# EAGLE design lcd_brd (EAGLE 6.2)
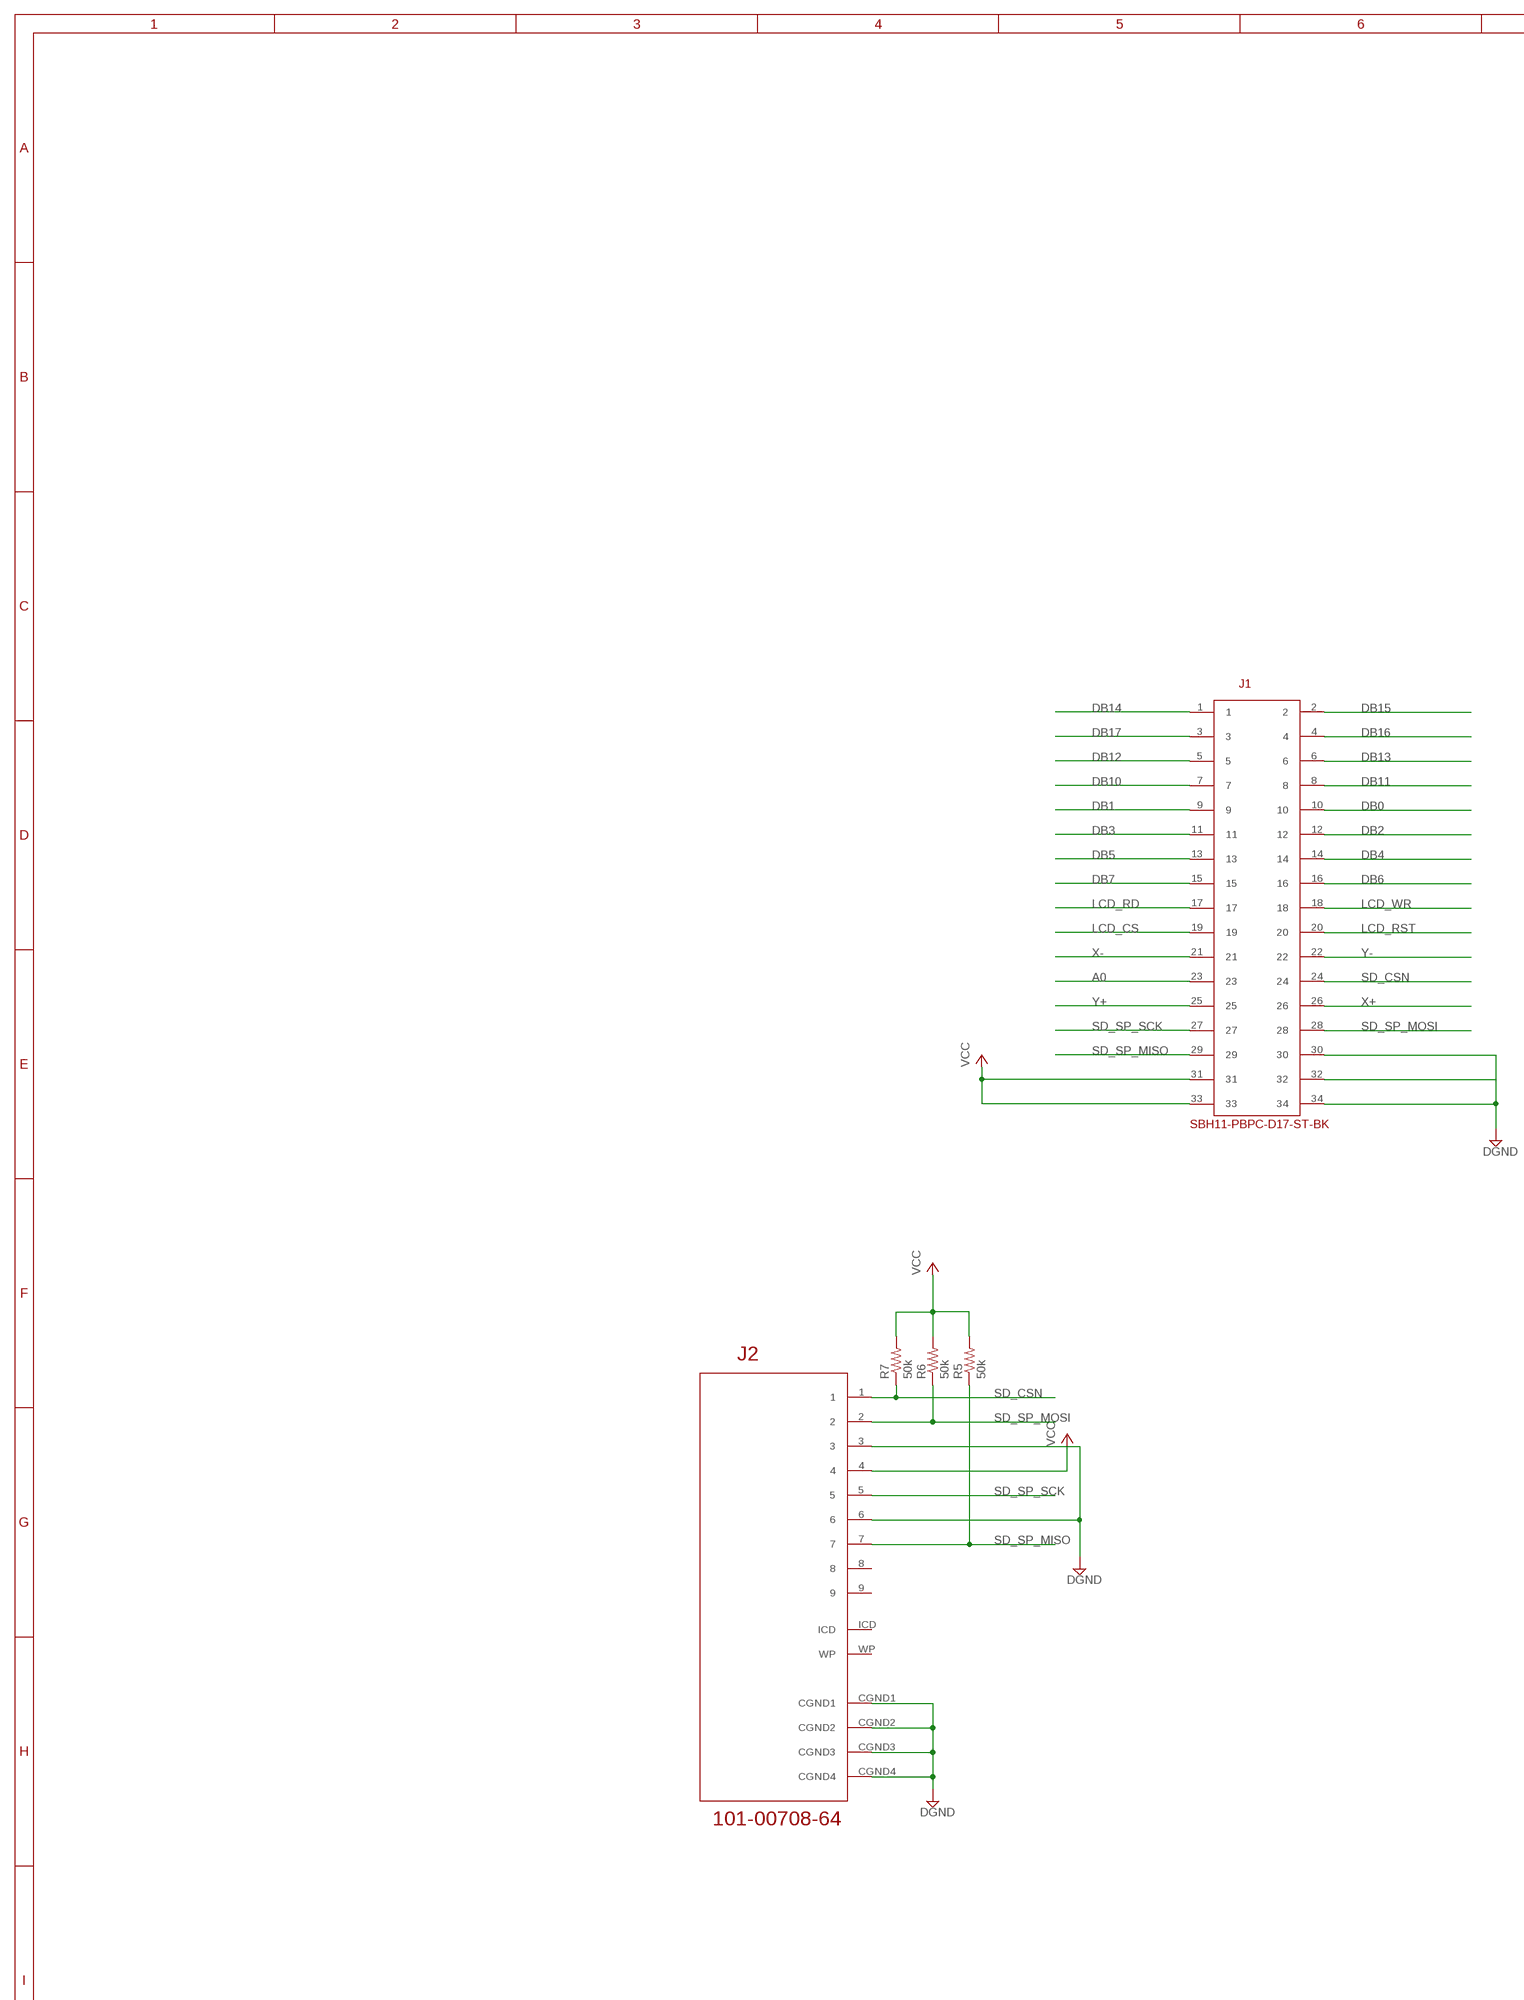
[diagram p0: schematic, sheet 1, part 1 of 2]
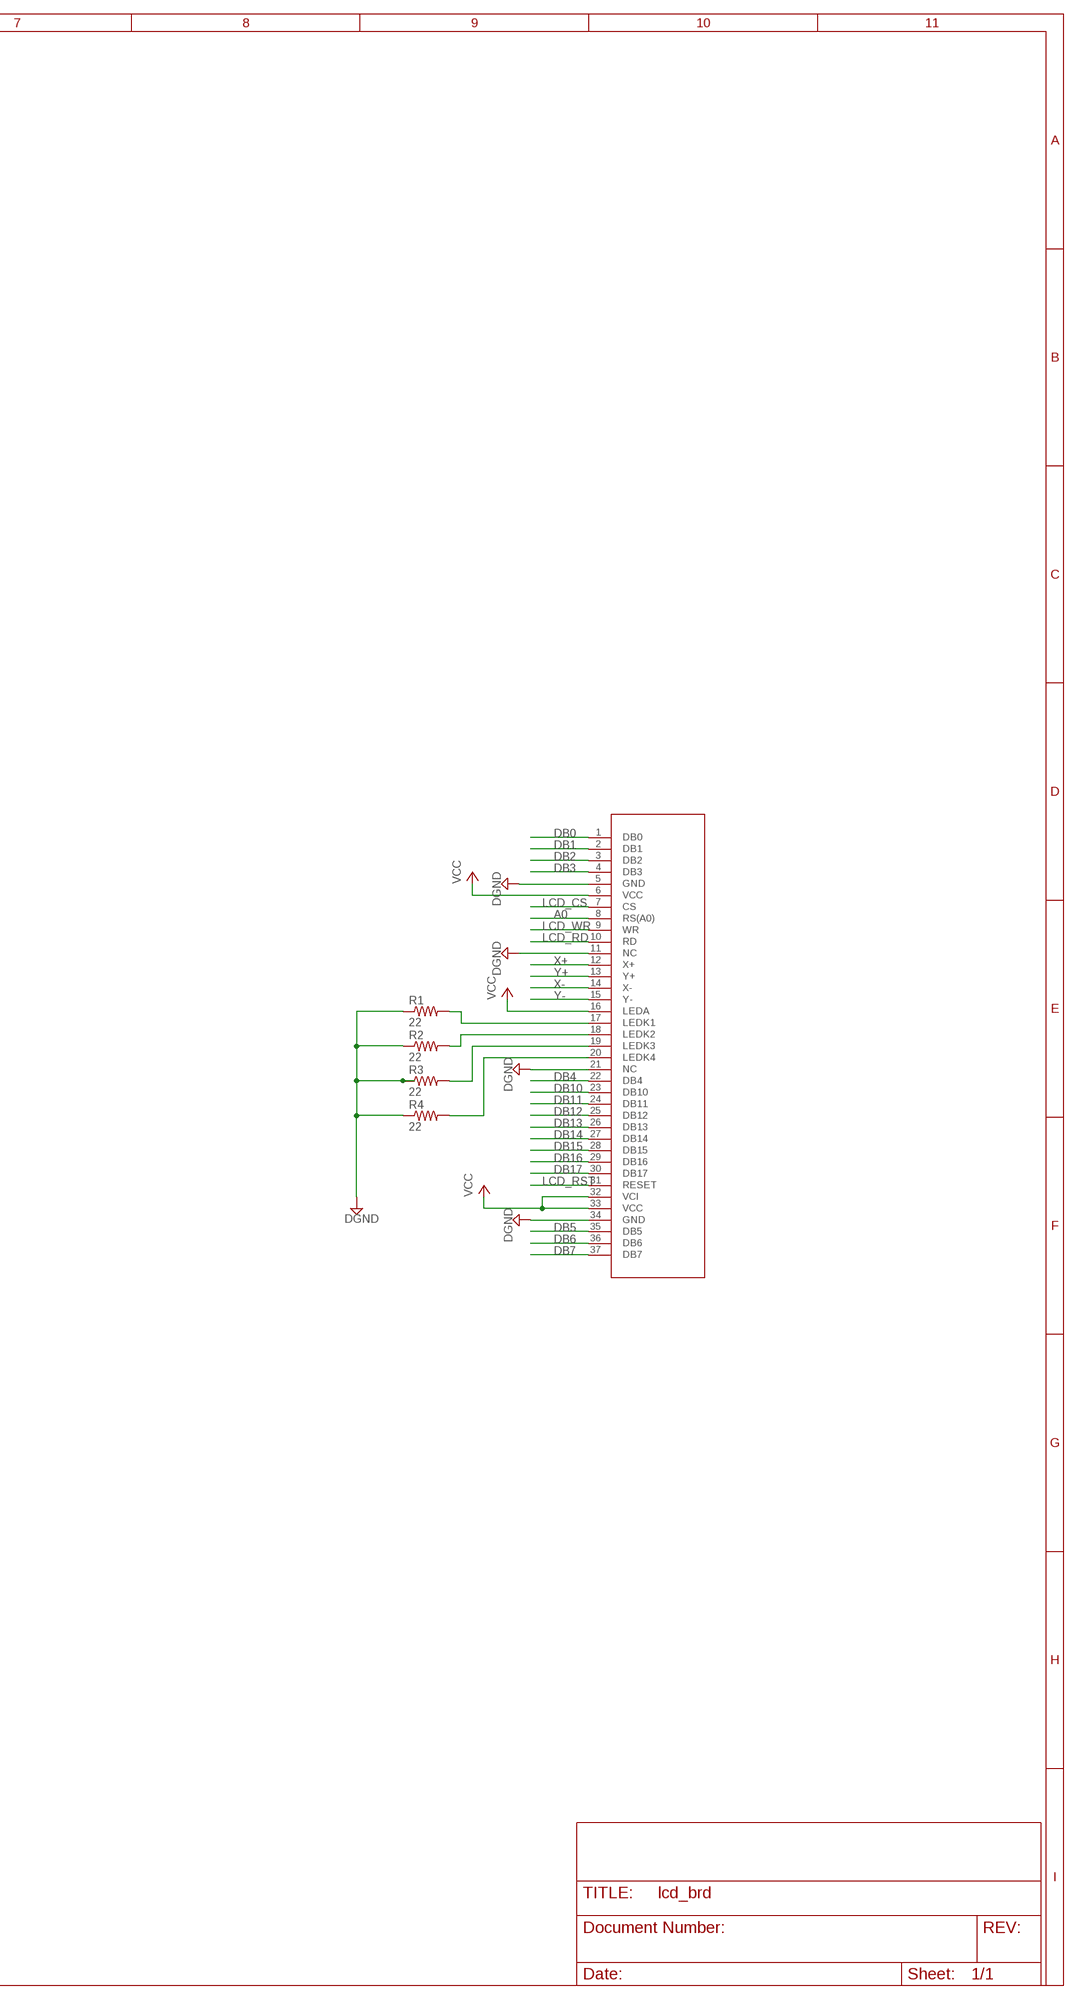
[diagram p1: schematic, sheet 1, part 2 of 2]

## Parts
J1  SBH11-PBPC-D17-ST-BK  [SBH11-PBPC-D17-ST-BK]
J2  101-00708-64  [101-00708-64]
R1  22  R-US_R0603  [R0603]
R2  22  R-US_R0603  [R0603]
R3  22  R-US_R0603  [R0603]
R4  22  R-US_R0603  [R0603]
R5  50k  R-US_R0603  [R0603]
R6  50k  R-US_R0603  [R0603]
R7  50k  R-US_R0603  [R0603]
U1  PETERATMEGA644_LCD37  [PETERATMEGA644_LCD371MM]

## Nets
A0: J1.23 U1.8(RS(A0))
DB0: J1.10 U1.1(DB0)
DB1: J1.9 U1.2(DB1)
DB2: J1.12 U1.3(DB2)
DB3: J1.11 U1.4(DB3)
DB4: J1.14 U1.22(DB4)
DB5: J1.13 U1.35(DB5)
DB6: J1.16 U1.36(DB6)
DB7: J1.15 U1.37(DB7)
DB10: J1.7 U1.23(DB10)
DB11: J1.8 U1.24(DB11)
DB12: J1.5 U1.25(DB12)
DB13: J1.6 U1.26(DB13)
DB14: J1.1 U1.27(DB14)
DB15: J1.2 U1.28(DB15)
DB16: J1.4 U1.29(DB16)
DB17: J1.3 U1.30(DB17)
DGND: J1.30 J1.32 J1.34 J2.3 J2.6 J2.CGND1 J2.CGND2 J2.CGND3 J2.CGND4 R1.1 R2.1 R3.1 R4.1 U1.5(GND) U1.11(NC) U1.21(NC) U1.34(GND)
LCD_CS: J1.19 U1.7(CS)
LCD_RD: J1.17 U1.10(RD)
LCD_RST: J1.20 U1.31(RESET)
LCD_WR: J1.18 U1.9(WR)
N$1: R1.2 U1.17(LEDK1)
N$3: R2.2 U1.18(LEDK2)
N$4: R3.2 U1.19(LEDK3)
N$6: R4.2 U1.20(LEDK4)
SD_CSN: J1.24 J2.1 R7.1
SD_SP_MISO: J1.29 J2.7 R5.1
SD_SP_MOSI: J1.28 J2.2 R6.1
SD_SP_SCK: J1.27 J2.5
VCC: J1.31 J1.33 J2.4 R5.2 R6.2 R7.2 U1.6(VCC) U1.16(LEDA) U1.32(VCI) U1.33(VCC)
X+: J1.26 U1.12(X+)
X-: J1.21 U1.14(X-)
Y+: J1.25 U1.13(Y+)
Y-: J1.22 U1.15(Y-)
Unconnected: J2.8 J2.9 J2.ICD J2.WP

## Library data of the parts
J1 = SBH11-PBPC-D17-ST-BK:SBH11-PBPC-D17-ST-BK
J2 = 101-00708-64:101-00708-64
R1-R7 = resistor:R-US_: RESISTOR, American symbol
U1 = microtouch:PETERATMEGA644_LCD37: 2.4 Inch LCD Panel JCTTQ2437PS01-T01

## Board
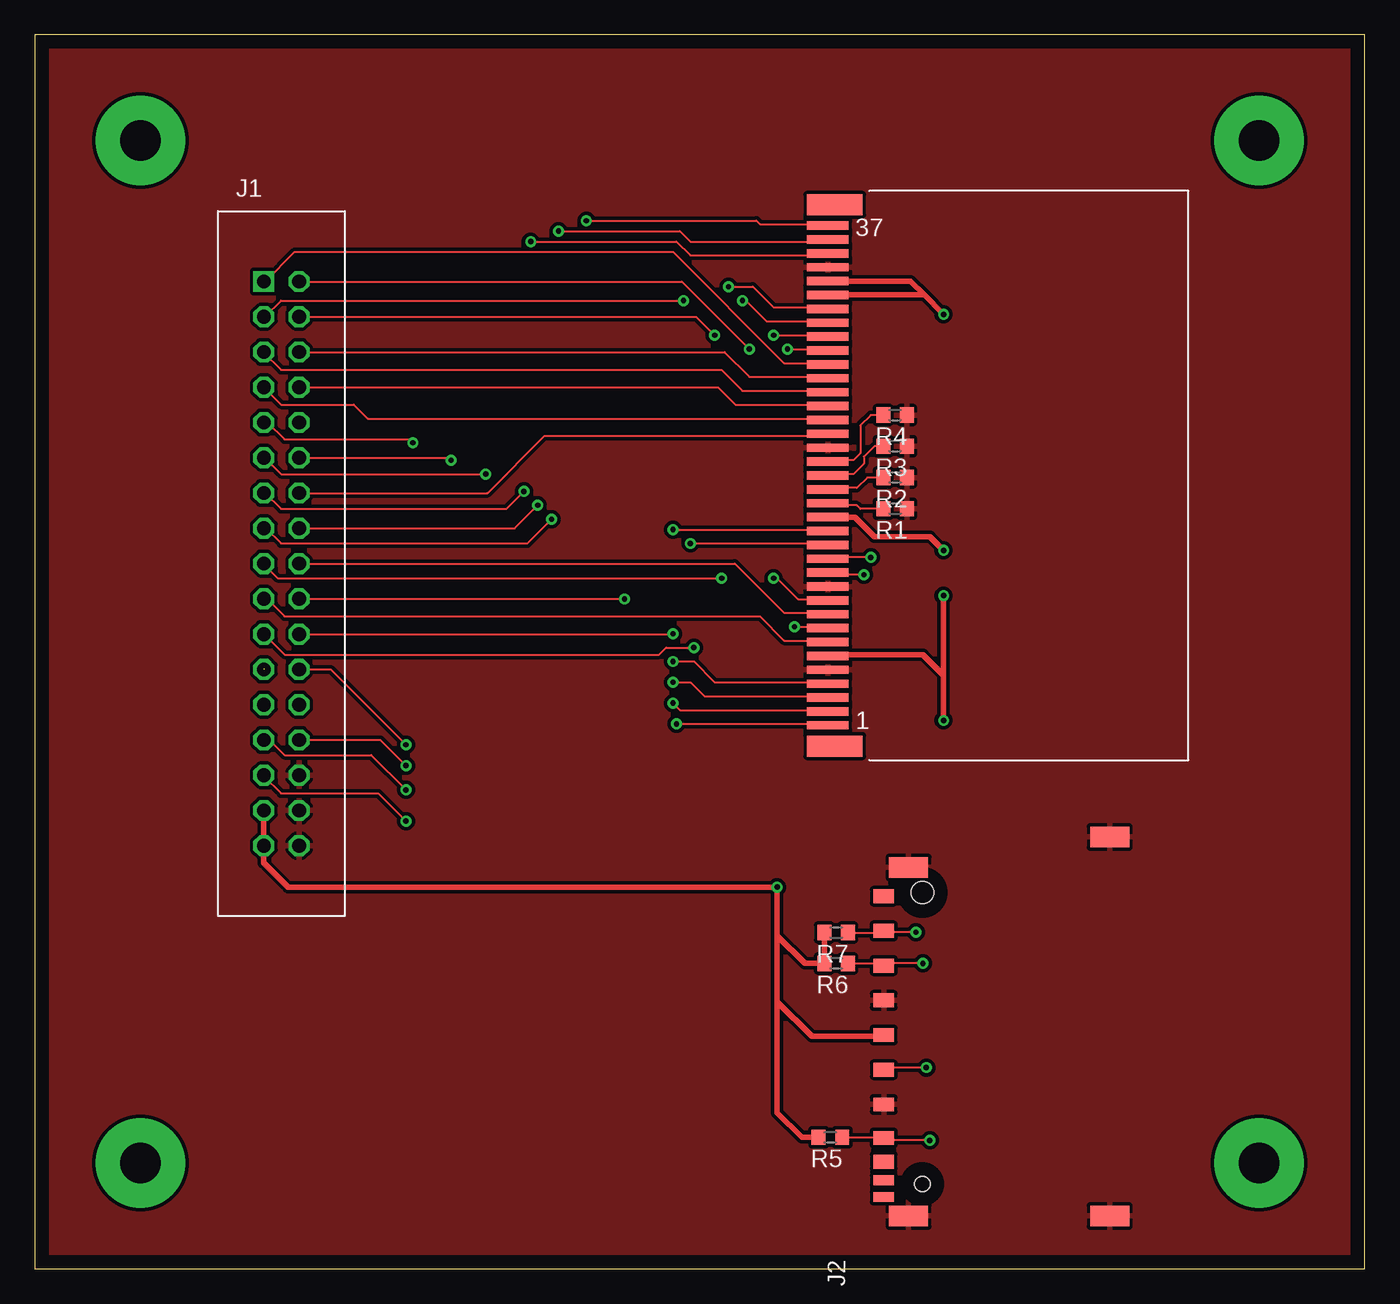
[diagram p2: board, top side]
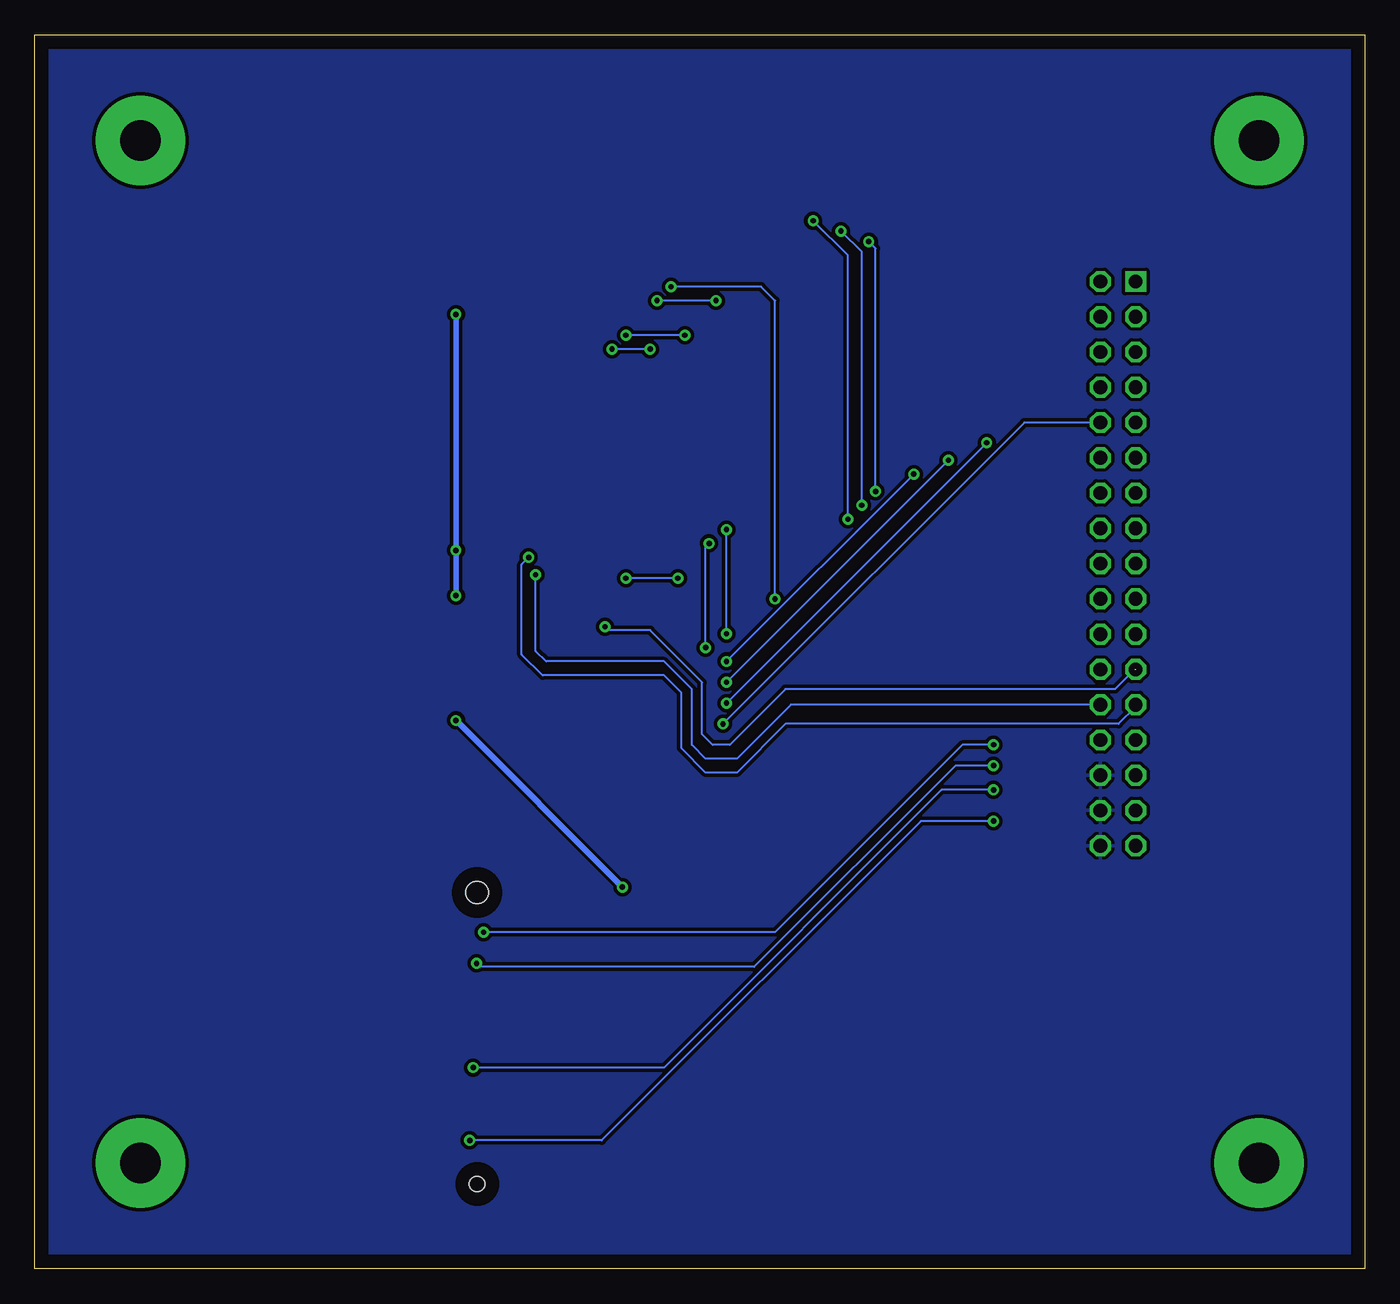
[diagram p3: board, bottom side, seen from below]

Size 95.85 x 88.9 mm. Coordinates in mm from the lower left corner, seen from the top.
Outline: 0,0 95.85,0 95.85,88.9 0,88.9 0,0
Copper layers (1*16): Top 0.035mm / dielectric 1.5mm / Bottom 0.035mm
Design rules: minimum track width 6mil, minimum drill 15mil, track to track 6mil, track to pad 6mil, pad to pad 6mil, via to via 6mil, smd to smd 6mil, copper to edge 40mil, drill to drill 8mil, minimum pad ring 10mil, minimum via ring 8mil, stop-mask expansion 4mil, vias tented up to drill 0mil, thermal gap 10mil

### Footprints (pad centres in the part's own frame; a part is rotated, then mirrored left to right if it is on the bottom)
SBH11-PBPC-D17-ST-BK = drill 0.991 square: 1 0,0 | drill 0.991 octagon: 2 2.54,0; 3 0,-2.54; 4 2.54,-2.54; 5 0,-5.08; 6 2.54,-5.08; 7 0,-7.62; 8 2.54,-7.62; 9 0,-10.16; 10 2.54,-10.16; 11 0,-12.7; 12 2.54,-12.7; 13 0,-15.24; 14 2.54,-15.24; 15 0,-17.78; 16 2.54,-17.78; 17 0,-20.32; 18 2.54,-20.32; 19 0,-22.86; 20 2.54,-22.86; 21 0,-25.4; 22 2.54,-25.4; 23 0,-27.94; 24 2.54,-27.94; 25 0,-30.48; 26 2.54,-30.48; 27 0,-33.02; 28 2.54,-33.02; 29 0,-35.56; 30 2.54,-35.56; 31 0,-38.1; 32 2.54,-38.1; 33 0,-40.64; 34 2.54,-40.64
101-00708-64 = smd 1 x 1.5: 1 20.53,16.29; 2 18.03,16.29; 3 15.53,16.29; 4 13.03,16.29; 5 10.53,16.29; 6 8.03,16.29; 7 5.61,16.29; 8 3.91,16.29; 9 23.03,16.29 | smd 1.5 x 2.8: CGND1 0,14.5; CGND2 25.1,14.5; CGND3 0,0; CGND4 27.3,0 | smd 0.7 x 1.5: ICD 2.57,16.29; WP 1.37,16.29 | hole 1.1: 2.3,13.5 | hole 1.6: 23.3,13.5
R0603 = smd 1 x 1.1: 1 -0.85,0; 2 0.85,0
PETERATMEGA644_LCD371MM = smd 3 x 0.6: 1 0,18; 2 0,17; 3 0,16; 4 0,15; 5 0,14; 6 0,13; 7 0,12; 8 0,11; 9 0,10; 10 0,9; 11 0,8; 12 0,7; 13 0,6; 14 0,5; 15 0,4; 16 0,3; 17 0,2; 18 0,1; 19 0,0; 20 0,-1; 21 0,-2; 22 0,-3; 23 0,-4; 24 0,-5; 25 0,-6; 26 0,-7; 27 0,-8; 28 0,-9; 29 0,-10; 30 0,-11; 31 0,-12; 32 0,-13; 33 0,-14; 34 0,-15; 35 0,-16; 36 0,-17; 37 0,-18 | smd 4 x 1.5: P$1 -0.5,19.5; P$2 -0.5,-19.5

### Placement (x,y rotation side)
J1  16.51,71.12 0 top
J2  77.47,3.81 90 top
R1  62,54.75 180 top
R2  62,57 180 top
R3  62,59.25 180 top
R4  62,61.5 180 top
R5  57.34,9.47 180 top
R6  57.75,22 180 top
R7  57.75,24.22 180 top
U1  57.15,57.15 180 top

### Tracks (layer width: path | path; a pad name or v marks a point on that pad's centre or on a via)
A0  (via drill 0.38)  (1 unrouted)
  Top 0.152: v54.75,46.25 57.05,46.25 U1.8
  Bottom 0.152: v54.75,46.25 54.5,46 51.5,46 47.75,42.25 47.75,38.5 47,37.75 45.75,37.75 41.75,41.75 18,41.75 16.57,43.18
DB0  (via drill 0.38)
  Top 0.152: v46.25,39.25 57.05,39.25 U1.1
  Bottom 0.152: J1.10 24.54,60.96 v46.25,39.25
DB1  (via drill 0.38)
  Top 0.152: J1.9 16.79,60.96 18,59.75 27,59.75 v27.25,59.5 | v46,40.75 46.5,40.25 57.05,40.25 U1.2
  Bottom 0.152: v27.25,59.5 v46,40.75
DB2  (via drill 0.38)
  Top 0.152: J1.12 29.83,58.42 v30,58.25 | v46,42.25 47.25,42.25 48.25,41.25 57.05,41.25 U1.3
  Bottom 0.152: v30,58.25 v46,42.25
DB3  (via drill 0.38)
  Top 0.152: J1.11 16.58,58.42 17.75,57.25 v32.5,57.25 | v46,43.75 47.5,43.75 49,42.25 57.05,42.25 U1.4
  Bottom 0.152: v32.5,57.25 v46,43.75
DB4
  Top 0.152: J1.14 32.63,55.88 36.75,60 57,60 U1.22
DB5  (via drill 0.38)
  Top 0.152: J1.13 16.62,55.88 17.75,54.75 34,54.75 v35.25,56 | v35.75,74 46.25,74 47.25,73 57,73 U1.35
  Bottom 0.152: v35.25,56 35.25,73.5 v35.75,74
DB6  (via drill 0.38)
  Top 0.152: J1.16 34.59,53.34 v36.25,55 | v37.75,74.75 46.5,74.75 47.25,74 57,74 U1.36
  Bottom 0.152: v36.25,55 36.25,73.25 v37.75,74.75
DB7  (via drill 0.38)
  Top 0.152: J1.15 16.66,53.34 17.75,52.25 35.5,52.25 v37.25,54 | v39.75,75.5 52,75.5 52.25,75.25 57.05,75.25 U1.37
  Bottom 0.152: v37.25,54 37.25,73 v39.75,75.5
DB10
  Top 0.152: J1.7 17.75,62.25 23,62.25 24,61.25 57.05,61.25 U1.23
DB11
  Top 0.152: J1.8 49.25,63.5 50.5,62.25 57.05,62.25 U1.24
DB12
  Top 0.152: J1.5 16.51,65.99 17.75,64.75 49.5,64.75 51,63.25 57.05,63.25 U1.25
DB13
  Top 0.152: J1.6 49.71,66.04 51.5,64.25 57.05,64.25 U1.26
DB14
  Top 0.152: J1.1 16.62,71.12 18.75,73.25 46,73.25 54,65.25 57.05,65.25 U1.27
DB15  (via drill 0.38)
  Top 0.152: J1.2 46.63,71.12 v51.5,66.25 | v54.25,66.25 57.05,66.25 U1.28
  Bottom 0.152: v51.5,66.25 v54.25,66.25
DB16  (via drill 0.38)
  Top 0.152: J1.4 47.67,68.58 v49,67.25 | v53.25,67.25 57.05,67.25 U1.29
  Bottom 0.152: v49,67.25 v53.25,67.25
DB17  (via drill 0.38)
  Top 0.152: J1.3 16.58,68.58 17.75,69.75 v46.75,69.75 | v51,69.75 51.25,69.75 52.75,68.25 57.05,68.25 U1.30
  Bottom 0.152: v46.75,69.75 v51,69.75
DGND
  pour Top (isolate 0.254): 0,89 95.75,89 96,0 0,0
  pour Bottom (isolate 0.254): 0,88.75 0.75,0 96.5,0 95.75,89 0,89
LCD_CS
  Top 0.152: J1.19 16.74,48.26 18,47 52.25,47 54,45.25 57.05,45.25 U1.7
LCD_RD  (via drill 0.38)
  Top 0.152: J1.17 16.51,50.74 17.5,49.75 v49.5,49.75 | v53.25,49.75 53.5,49.75 55,48.25 57.05,48.25 U1.10
  Bottom 0.152: v49.5,49.75 v53.25,49.75
LCD_RST  (via drill 0.38)
  Top 0.152: J1.20 v42.49,48.26 v42.5,48.25 | v50,70.75 51.75,70.75 53.25,69.25 57.05,69.25 U1.31
  Bottom 0.152: v42.5,48.25 42.5,69.75 43.5,70.75 v50,70.75
LCD_WR
  Top 0.152: J1.18 50.45,50.8 54,47.25 57.05,47.25 U1.9
N$1
  Top 0.152: R1.2 59.5,54.75 59.25,55 57.3,55 U1.17
N$2  (via drill 2.95 pad 6.45)
  other vias: 7.62,81.28
N$3
  Top 0.152: R2.2 60,57 59.25,56.25 57.25,56.25 U1.18
N$4
  Top 0.152: R3.2 60.5,59.25 59.75,58.5 59.75,58 59,57.25 57.25,57.25 U1.19
N$5  (via drill 2.95 pad 6.45)
  other vias: 88.23,81.28
N$6
  Top 0.152: R4.2 60.25,61.5 59.5,60.75 59.5,58.75 59,58.25 57.25,58.25 U1.20
N$7  (via drill 2.95 pad 6.45)
  other vias: 88.23,7.62
N$8  (via drill 2.95 pad 6.45)
  other vias: 7.62,7.62
SD_CSN  (via drill 0.38)
  Top 0.152: R7.1 61.06,24.22 | J1.24 21.32,43.18 v26.75,37.75 | v63.5,24.25 61.27,24.25 J2.1
  Top 0.406: 61.06,24.22 J2.1
  Bottom 0.152: v26.75,37.75 29,37.75 42.5,24.25 v63.5,24.25
SD_SP_MISO  (via drill 0.38)
  Top 0.152: J1.29 16.51,35.49 17.75,34.25 24.75,34.25 v26.75,32.25 | v64.5,9.25 61.35,9.25 J2.7 61.13,9.47 R5.1
  Bottom 0.152: v26.75,32.25 32,32.25 55,9.25 v64.5,9.25
SD_SP_MOSI  (via drill 0.38)
  Top 0.152: R6.1 61.02,22 | J1.28 24.9,38.1 v26.75,36.25 | v64,22 61.34,22 J2.2
  Top 0.406: 61.02,22 J2.2
  Bottom 0.152: v26.75,36.25 29.5,36.25 44,21.75 63.75,21.75 v64,22
SD_SP_SCK  (via drill 0.38)
  Top 0.152: J1.27 16.9,38.1 18,37 24.25,37 v26.75,34.5 | v64.25,14.5 61.34,14.5 J2.5
  Bottom 0.152: v26.75,34.5 30.5,34.5 50.5,14.5 v64.25,14.5
VCC  (via drill 0.38)
  Top 0.406: J1.33 J1.31 16.5,33 16.5,29.25 18.25,27.5 v53.5,27.5 53.5,24 | v65.5,39.5 65.5,42.75 | 65.5,42.75 64,44.25 57.25,44.25 U1.6 | U1.33 63.1,71.15 64.1,70.15 | 64.1,70.15 v65.5,68.75 | U1.32 64.1,70.15 | 65.5,42.75 v65.5,48.5 | U1.16 59.1,54.15 60.5,52.75 64.5,52.75 v65.5,51.75 | 53.5,24 53.5,19.25 | 53.5,19.25 56,16.75 61.09,16.75 J2.4 | R7.2 R6.2 55.5,22 53.5,24 | R5.2 55.28,9.47 53.5,11.25 53.5,19.25
  Bottom 0.406: v53.5,27.5 v65.5,39.5 | v65.5,48.5 v65.5,51.75 v65.5,68.75
X+  (via drill 0.38)
  Top 0.152: 57,50 U1.12 57.3,50 v59.75,50
  Bottom 0.152: J1.26 41.36,40.64 45.25,36.75 47.5,36.75 48.5,37.75 48.5,41.75 50.5,43.75 59,43.75 59.75,44.5 v59.75,50
X-  (via drill 0.38)
  Top 0.152: J1.21 16.53,45.72 18,44.25 45,44.25 45.5,44.75 v47.5,44.75 | v47.25,52.25 57.05,52.25 U1.14
  Bottom 0.152: v47.5,44.75 47.5,52 v47.25,52.25
Y+  (via drill 0.38)
  Top 0.152: v60.25,51.25 57.25,51.25 U1.13
  Bottom 0.152: J1.25 16.51,40.49 17.75,39.25 41.75,39.25 45.25,35.75 47.5,35.75 49.25,37.5 49.25,41.5 50.5,42.75 59.25,42.75 60.75,44.25 60.75,50.75 v60.25,51.25
Y-  (via drill 0.38)
  Top 0.152: J1.22 45.97,45.72 v46,45.75 | v46,53.25 57.05,53.25 U1.15
  Bottom 0.152: v46,45.75 v46,53.25